# EAGLE design ToolTron_ToolBoxv2.0 (EAGLE 6.2)
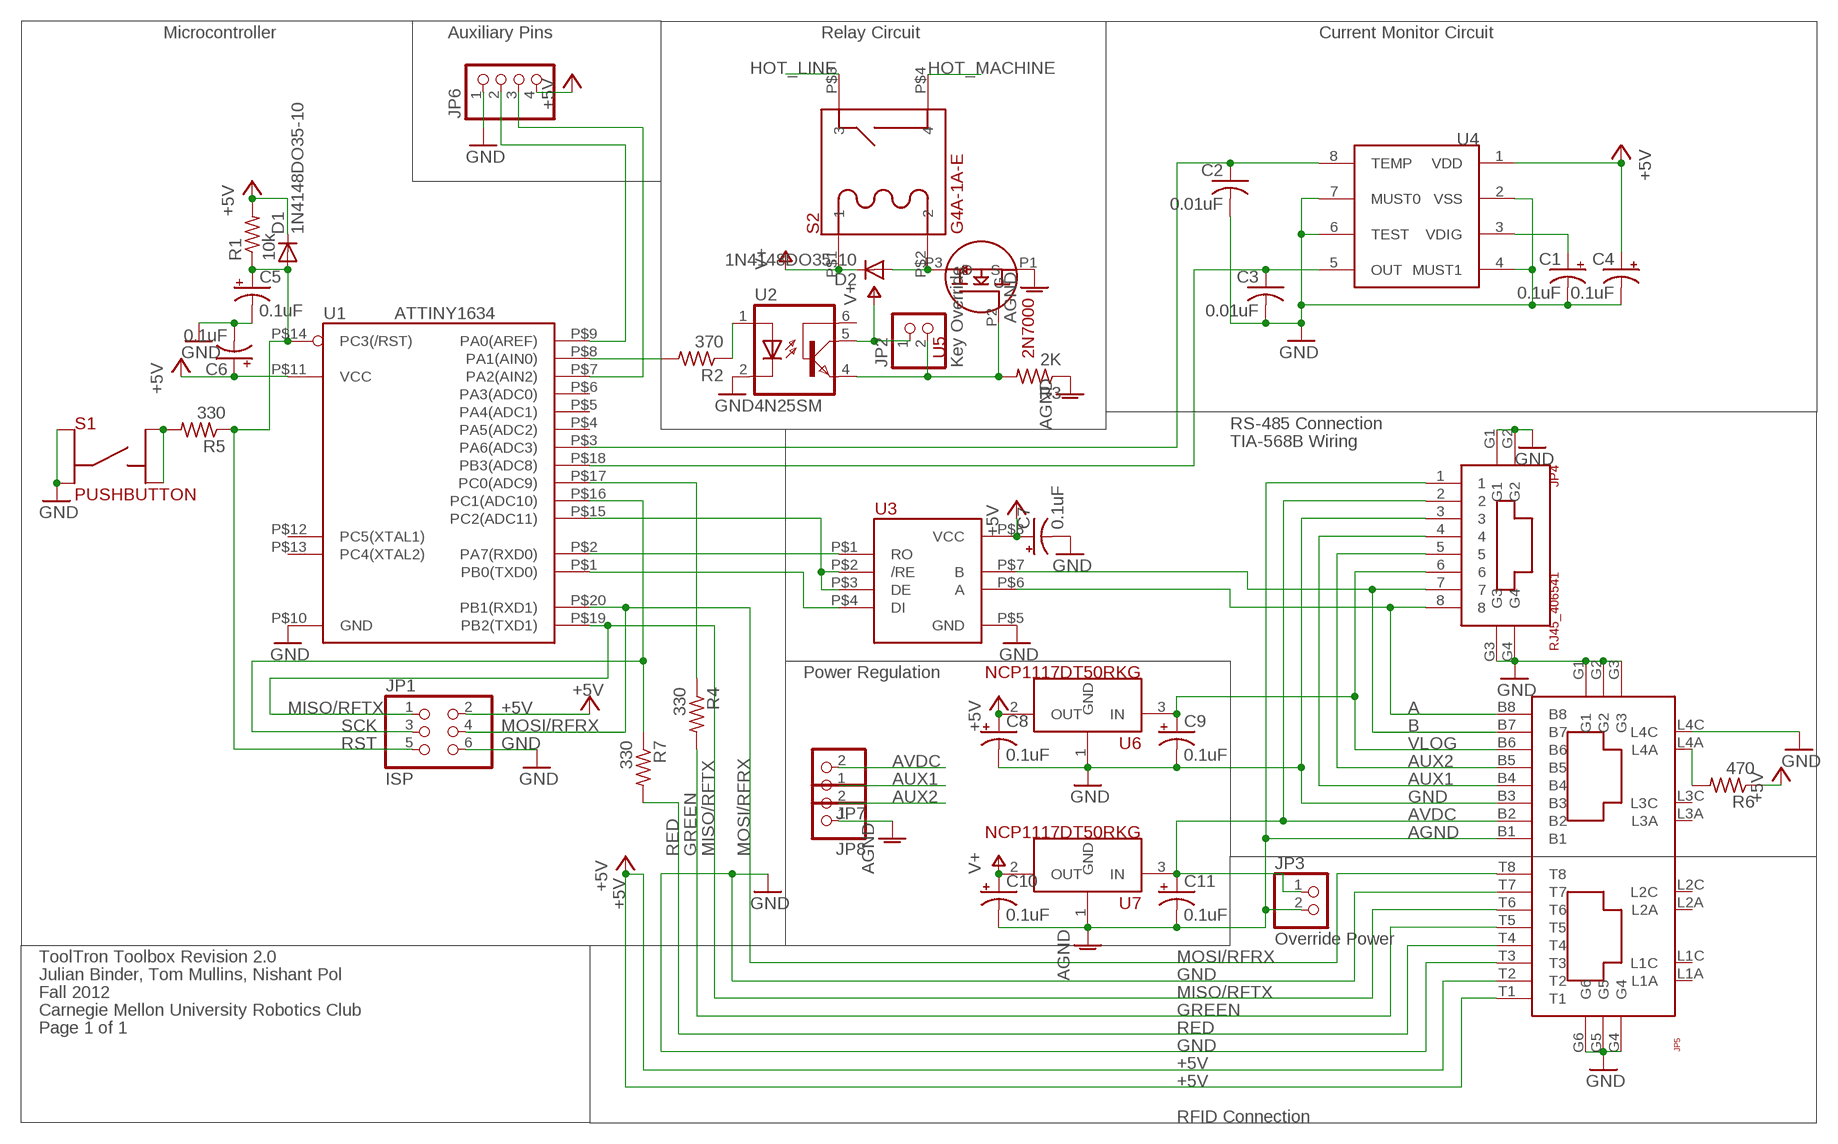
[diagram p0: schematic, sheet 1]

## Parts
C1  0.1uF  CPOL-USUD-4X5,8  [UD-4X5,8_NICHICON]
C2  0.01uF  C-USC0805  [C0805]
C3  0.01uF  C-USC0805  [C0805]
C4  0.1uF  CPOL-USUD-4X5,8  [UD-4X5,8_NICHICON]
C5  0.1uF  CPOL-USE2-5  [E2-5]
C6  0.1uF  CPOL-USE2-5  [E2-5]
C7  0.1uF  CPOL-USE2-5  [E2-5]
C8  0.1uF  CPOL-USE2-5  [E2-5]
C9  0.1uF  CPOL-USE2-5  [E2-5]
C10  0.1uF  CPOL-USUD-4X5,8  [UD-4X5,8_NICHICON]
C11  0.1uF  CPOL-USUD-4X5,8  [UD-4X5,8_NICHICON]
D1  1N4148DO35-10  [DO35-10]
D2  1N4148DO35-10  [DO35-10]
JP1  ISP  PINHD-2X3  [2X03]
JP2  Key Override  HEADER-1X2  [1X02_OVAL]
JP3  Override Power  HEADER-1X2  [1X02_OVAL]
JP4  RJ45_406541  [1-406541-1]
JP5  2XRJ45_RJSAE538X02X  [RJSAE538X02X]
JP6  HEADER-1X4ROUND  [1X04_ROUND]
JP7  HEADER-1X2ROUND  [1X02_ROUND]
JP8  HEADER-1X2ROUND  [1X02_ROUND]
R1  10k  R-US_0207/10  [0207/10]
R2  370  R-US_0207/10  [0207/10]
R3  2K  R-US_0207/10  [0207/10]
R4  330  R-US_0207/10  [0207/10]
R5  330  R-US_0207/10  [0207/10]
R6  470  R-US_0207/10  [0207/10]
R7  330  R-US_0207/10  [0207/10]
S1  PUSHBUTTON  [FSM4JH]
S2  G4A-1A-E  [G4A-1A-E]
U1  ATTINY1634  [SOIC-20]
U2  4N25SM  [DIL6-SMD]
U3  MAX13082E  [SOIC-8]
U4  MLX91206  [SOIC-8]
U5  2N7000  [TO-92]
U6  NCP1117DT50RKG  [DPAK]
U7  NCP1117DT50RKG  [DPAK]

## Nets
+5V: C4.+ C6.+ C7.+ C8.+ D1.C JP1.2 JP5.T1 JP5.T2 JP6.4 R1.2 R6.1 U1.P$11(VCC) U3.P$8(VCC) U4.1(VDD) U6.2(OUT)
A: JP4.8 JP5.B8 U3.P$6(A)
AGND: C10.- C11.- JP3.2 JP4.1 JP5.B1 JP8.1 R3.1 U5.P1(S) U7.1(GND)
AUX1: JP4.4 JP5.B4 JP7.1
AUX2: JP4.5 JP5.B5 JP8.2
AVDC: C11.+ JP3.1 JP4.2 JP5.B2 JP7.2 U7.3(IN)
B: JP4.7 JP5.B7 U3.P$7(B)
DI: U1.P$1(PB0(TXD0)) U3.P$4(DI)
EN: U1.P$15(PC2(ADC11)) U3.P$2(/RE) U3.P$3(DE)
GND: C1.- C2.2 C3.2 C4.- C5.- C6.- C7.- C8.- C9.- JP1.6 JP4.3 JP4.G1 JP4.G2 JP4.G3 JP4.G4 JP5.B3 JP5.G1 JP5.G2 JP5.G3 JP5.G4 JP5.G5 JP5.G6 JP5.L4C JP5.T3 JP5.T7 JP6.1 S1.1 S1.2 U1.P$10(GND) U2.2(C) U3.P$5(GND) U4.2(VSS) U4.4(MUST1) U4.6(TEST) U4.7(MUST0) U6.1(GND)
GREEN: JP5.T5 R4.2
HOT_LINE: S2.P$3
HOT_MACHINE: S2.P$4
MISO/RFTX: JP1.1 JP5.T6 U1.P$19(PB2(TXD1))
MOSI/RFRX: JP1.4 JP5.T8 U1.P$20(PB1(RXD1))
N$1: D2.A S2.P$2 U5.P3(D)
N$2: R5.2 S1.3 S1.4
N$3: C3.1 U1.P$18(PB3(ADC8)) U4.5(OUT)
N$4: C1.+ U4.3(VDIG)
N$5: C2.1 U1.P$3(PA6(ADC3)) U4.8(TEMP)
N$8: R2.2 U1.P$8(PA1(AIN0))
N$10: R2.1 U2.1(A)
N$11: JP2.2 R3.2 U2.4(EMI) U5.P2(G)
N$16: JP5.L4A R6.2
N$18: JP5.L1C
N$19: R4.1 U1.P$17(PC0(ADC9))
PA0: JP6.2 U1.P$9(PA0(AREF))
PA2: JP6.3 U1.P$7(PA2(AIN2))
RED: JP5.T4 R7.2
RO: U1.P$2(PA7(RXD0)) U3.P$1(RO)
RST: C5.+ D1.A JP1.5 R1.1 R5.1 U1.P$14(PC3(/RST))
SCK: JP1.3 R7.1 U1.P$16(PC1(ADC10))
V+: C10.+ D2.C JP2.1 S2.P$1 U2.5(COL) U7.2(OUT)
VLOG: C9.+ JP4.6 JP5.B6 U6.3(IN)
Unconnected: JP5.L1A JP5.L2A JP5.L2C JP5.L3A JP5.L3C U1.P$4(PA5(ADC2)) U1.P$5(PA4(ADC1)) U1.P$6(PA3(ADC0)) U1.P$12(PC5(XTAL1)) U1.P$13(PC4(XTAL2)) U2.6(BAS)

## Notes on the sheet
- Microcontroller | Auxiliary Pins | Relay Circuit | Current Monitor Circuit
- RS-485 Connection
- TIA-568B Wiring
- Power Regulation
- ToolTron Toolbox Revision 2.0
- Julian Binder, Tom Mullins, Nishant Pol
- Fall 2012
- Carnegie Mellon University Robotics Club
- Page 1 of 1
- RFID Connection

## Library data of the parts
C1 C4-C11 = rcl:CPOL-US: POLARIZED CAPACITOR, American symbol
C2 C3 = rcl:C-US: CAPACITOR, American symbol
D1 D2 = diode:1N4148: DIODE high speed (Philips)
JP1 = pinhead:PINHD-2X3: PIN HEADER
JP2 JP3 JP7 JP8 = microbuilder:HEADER-1X2: PIN HEADER
JP4 = npol_custom:RJ45_406541: RJ45 Jack TE Connectivity 1-406541-1 Digikey A97716-ND
JP5 = npol_custom:2XRJ45_RJSAE538X02X: Double RJ45 Jack Amphenol RJSAE538002 Digikey RJSAE538002-ND
JP6 = microbuilder:HEADER-1X4: PIN HEADER
R1-R7 = rcl:R-US_: RESISTOR, American symbol
S1 = npol_custom:PUSHBUTTON
S2 = power_custom:G4A-1A-E
U1 = npol_custom:ATTINY1634
U2 = optocoupler:4N*?M: General Purpose 6-Pin Phototransistor Optocouplers Source: http://www.fairchildsemi.com/ds/4N/4N35-M.pdf; MF: FAIRCHILD SEMICONDUCTOR; MPN: 4N25SM; OC_FARNELL: 1021152; OC_NEWARK: 34C2020
U3 = IC_custom:MAX13082E
U4 = melexis_2:MLX91206
U5 = IC_custom:2N7000: N-Channel MOSFET 400mA 60V
U6 U7 = npol_custom:NCP1117DT50RKG

## Board
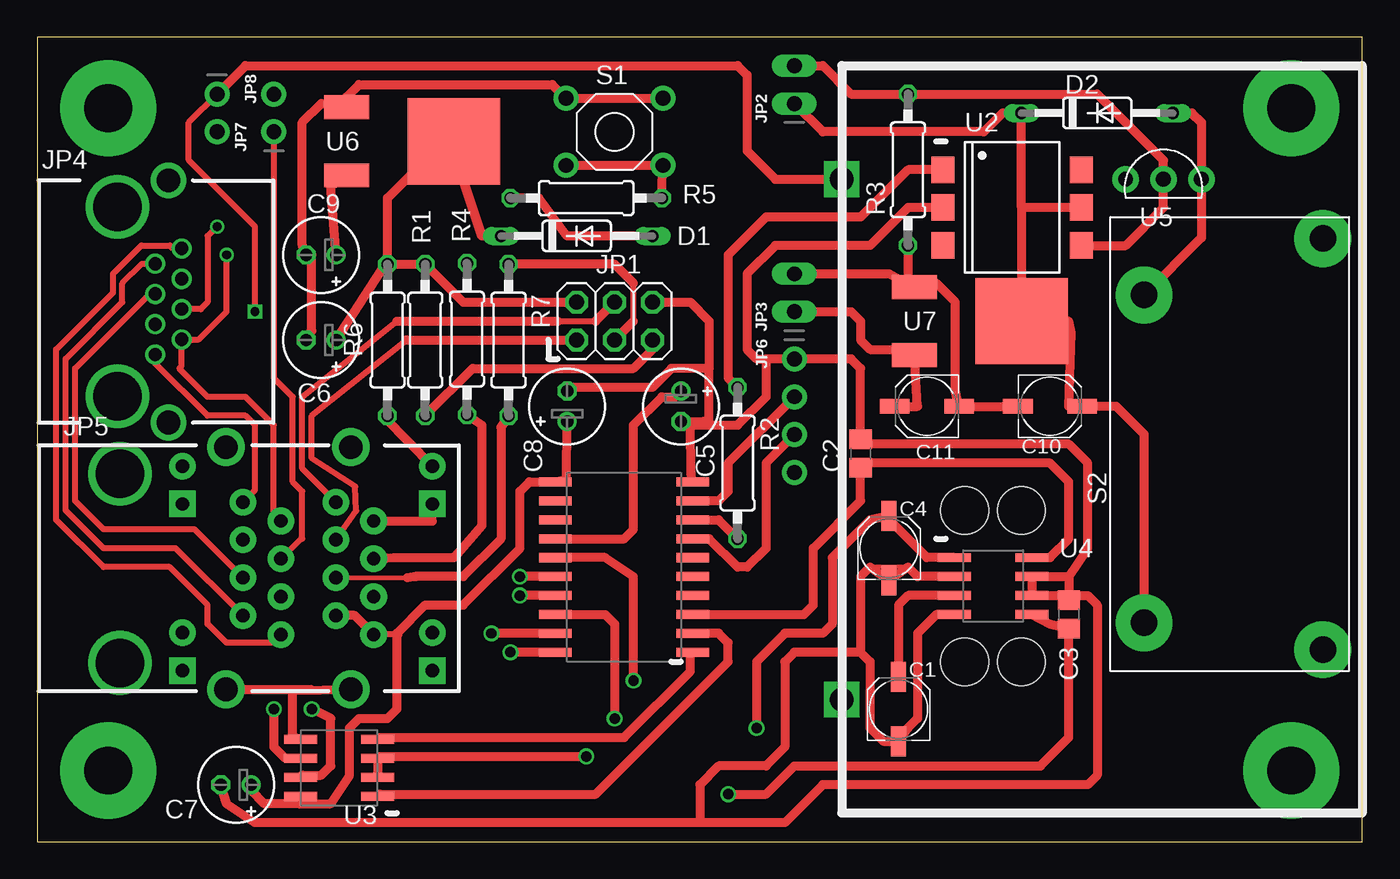
[diagram p1: board, top side]
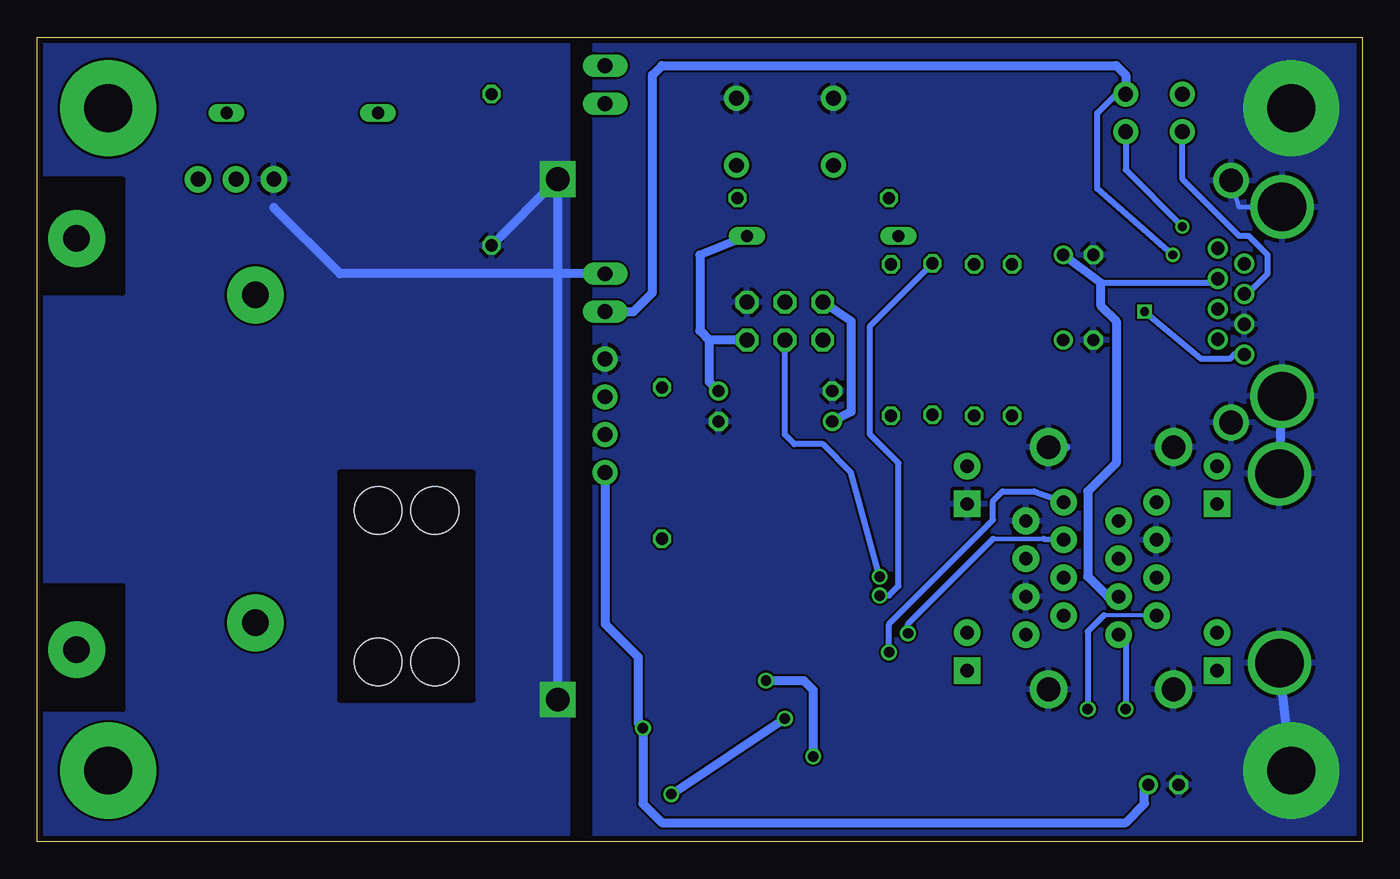
[diagram p2: board, bottom side, seen from below]

Size 88.9 x 53.98 mm. Coordinates in mm from the lower left corner, seen from the top.
Outline: 0,0 88.9,0 88.9,53.98 0,53.98 0,0
Copper layers (1*16): Top 0.0356mm / dielectric 1.5011mm / Bottom 0.0356mm
Design rules: minimum track width 6mil, minimum drill 13mil, track to track 6mil, track to pad 6mil, pad to pad 6mil, via to via 6mil, smd to smd 6mil, copper to edge 15mil, drill to drill 6mil, minimum pad ring 7mil, minimum via ring 7mil, stop-mask expansion 4mil, vias tented up to drill 0mil, thermal gap 10mil
Holes 3.2 mm at 66.04,12.06 62.23,12.06 66.04,22.23 62.23,22.23

### Footprints (pad centres in the part's own frame; a part is rotated, then mirrored left to right if it is on the bottom)
UD-4X5,8_NICHICON = smd 2 x 1: + 2.159,0; - -2.159,0
C0805 = smd 1.3 x 1.5: 1 -0.95,0; 2 0.95,0
E2-5 = drill 0.813 pad 1.27: + -1.016,0 | drill 0.813 pad 1.27 octagon: - 1.016,0
DO35-10 = drill 0.813 long: A 5.08,0; C -5.08,0
2X03 = drill 1.016 octagon: 1 -2.54,-1.27; 2 -2.54,1.27; 3 0,-1.27; 4 0,1.27; 5 2.54,-1.27; 6 2.54,1.27
1X02_OVAL = drill 1 long: 1 -1.27,0; 2 1.27,0
1-406541-1 = drill 0.9: 1 3.556,2.54; 2 2.54,4.318; 3 1.524,2.54; 4 0.508,4.318; 5 -0.508,2.54; 6 -1.524,4.318; 7 -2.54,2.54; 8 -3.556,4.318 | drill 3.251: G1 6.35,0; G2 -6.35,0 | drill 1.6: G3 8.128,3.429; G4 -8.128,3.429
RJSAE538X02X = drill 0.9 pad 1.778: B1 -4.445,8.255; B2 -3.175,10.795; B3 -1.905,8.255; B4 -0.635,10.795; B5 0.635,8.255; B6 1.905,10.795; B7 3.175,8.255; B8 4.445,10.795; L1A 4.318,4.191; L2A -6.858,4.191; L3A 4.318,20.955; L4A -6.858,20.955; T1 4.445,17.018; T2 3.175,14.478; T3 1.905,17.018; T4 0.635,14.478; T5 -0.635,17.018; T6 -1.905,14.478; T7 -3.175,17.018; T8 -4.445,14.478 | drill 1.587 pad 2.54: G1 8.128,7.112; G2 8.128,15.494; G3 -8.128,7.112; G4 -8.128,15.494 | drill 3.251 pad 3.81: G5 -6.35,0; G6 6.35,0 | drill 0.9 pad 1.778 square: L1C 6.858,4.191; L2C -4.318,4.191; L3C 6.858,20.955; L4C -4.318,20.955
1X04_ROUND = drill 1 pad 1.676: 1 -3.81,0; 2 -1.27,0; 3 1.27,0; 4 3.81,0
1X02_ROUND = drill 1 pad 1.676: 1 -1.27,0; 2 1.27,0
0207/10 = drill 0.813 octagon: 1 -5.08,0; 2 5.08,0
FSM4JH = drill 1 pad 1.676: 1 -3.251,2.248; 2 3.251,2.248; 3 -3.251,-2.248; 4 3.251,-2.248
G4A-1A-E = drill 1.778 pad 3.81: P$1 11.989,-5.74; P$2 -10.008,-5.74; P$3 -13.792,6.248; P$4 13.792,6.248
SOIC-20 = smd 2.184 x 0.61: P$1 -4.597,5.715; P$2 -4.597,4.445; P$3 -4.597,3.175; P$4 -4.597,1.905; P$5 -4.597,0.635; P$6 -4.597,-0.635; P$7 -4.597,-1.905; P$8 -4.597,-3.175; P$9 -4.597,-4.445; P$10 -4.597,-5.715; P$11 4.597,-5.715; P$12 4.597,-4.445; P$13 4.597,-3.175; P$14 4.597,-1.905; P$15 4.597,-0.635; P$16 4.597,0.635; P$17 4.597,1.905; P$18 4.597,3.175; P$19 4.597,4.445; P$20 4.597,5.715
DIL6-SMD = smd 1.78 x 1.52: 1 -2.54,-4.645; 2 0,-4.645; 3 2.54,-4.645; 4 2.54,4.645; 5 0,4.645; 6 -2.54,4.645
SOIC-8 = smd 2.21 x 0.61: P$1 -2.591,1.905; P$2 -2.591,0.635; P$3 -2.591,-0.635; P$4 -2.591,-1.905; P$5 2.591,-1.905; P$6 2.591,-0.635; P$7 2.591,0.635; P$8 2.591,1.905
SOIC-8' = smd 2.2 x 0.6: 1 -2.6,1.905; 2 -2.6,0.635; 3 -2.6,-0.635; 4 -2.6,-1.905; 5 2.6,-1.905; 6 2.6,-0.635; 7 2.6,0.635; 8 2.6,1.905
TO-92 = drill 1 pad 1.778: P1 2.54,0; P2 0,0; P3 -2.54,0
DPAK = smd 2.997 x 1.6: 1 7.188,-2.286; 3 7.188,2.286 | smd 6.198 x 5.791: 2 0,0

### Placement (x,y rotation side)
C1  57.78,8.89 90 top
C2  55.24,26.04 90 top
C3  69.22,15.24 90 top
C4  57.15,19.68 90 top
C5  43.18,29.21 270 top
C6  19.05,33.66 180 top
C7  13.34,3.81 180 top
C8  35.56,29.21 90 top
C9  19.05,39.37 180 top
C10  67.94,29.21 0 top
C11  59.69,29.21 180 top
D1  36.2,40.64 0 top
D2  71.12,48.9 0 top
JP1  38.73,34.92 0 top
JP2  50.8,50.8 90 top
JP3  50.8,36.83 90 top
JP4  5.37,36.24 270 top
JP5  5.55,18.34 270 top
JP6  50.8,28.57 270 top
JP7  15.88,48.9 90 top
JP8  12.06,48.9 270 top
R1  26.04,33.66 90 top
R2  46.99,25.4 270 top
R3  58.42,45.09 90 top
R4  28.83,33.72 270 top
R5  36.83,43.18 0 top
R6  23.5,33.66 270 top
R7  31.62,33.66 270 top
S1  38.73,47.62 0 top
S2  80.01,26.67 270 top
U1  39.37,18.41 180 top
U2  65.41,42.55 270 top
U3  20.26,4.95 180 top
U4  MLX91206  [SOIC-8']  64.14,17.14 0 top
U5  75.56,44.45 180 top
U6  27.94,46.99 180 top
U7  66.04,34.92 180 top

### Tracks (layer width: path | path; a pad name or v marks a point on that pad's centre or on a via)
+5V  (via drill 0.7)
  Top 0.406: U3.P$8 17.54,2.54 | 24.21,13.89 JP5.T1
  Top 0.61: U4.1 59.69,19.05 57.4,21.34 C4.+ 55.88,21.59 53.34,19.05 53.34,14.61 52.7,13.97 50.16,13.97 48.26,12.06 v48.26,7.62 | C6.+ 23.5,38.99 | 23.5,38.99 R6.1 R1.2 28.57,36.2 JP1.2 | 23.5,38.99 23.5,43.18 27.3,46.99 U6.2 28.57,46.35 28.57,44.45 29.84,40.64 D1.C | C7.+ 14.35,3.43 15.24,2.54 17.54,2.54 19.68,2.54 20.95,4.45 20.95,7.62 21.59,8.26 23.5,8.26 24.13,8.89 24.13,13.97 | 24.13,13.97 24.21,13.89 | JP5.T1 21.3,15.16 JP5.T2 | 24.13,13.97 26.04,15.88 28.57,15.88 32.38,19.68 32.38,23.5 33.02,24.13 U1.P$11 35.51,24.33 C8.+
  Bottom 0.61: JP1.2 34.29,34.92 34.29,28.83 C8.+ | C7.+ 14.61,3.56 14.61,2.54 15.88,1.27 46.99,1.27 48.26,2.54 v48.26,7.62 48.58,7.94 48.58,12.38 50.8,14.61 JP6.4
A  (via drill 0.7)
  Top 0.406: 16.64,5.59 U3.P$6 | JP5.B8 15.79,13.34 12.7,13.34 11.43,14.61 11.43,15.88 8.89,18.41 4.45,18.41 1.27,21.59 1.27,33.02 5.08,36.83 5.08,38.1 6.99,40.01 8.89,40.01 9.1,39.8 JP4.8
  Top 0.61: v15.88,8.89 15.88,6.35 16.64,5.59
  Bottom 0.305: JP5.B8 16.42,13.97
  Bottom 0.406: JP5.B8 16.51,13.73 16.9,13.73 15.88,13.34 v15.88,8.89
AGND  (via drill 0.6, 1.6)
  Top 0.406: JP5.B1 14.61,23.58 14.61,27.94 13.97,28.57 11.43,28.57 7.91,32.09 JP4.1 | v14.61,35.56 14.61,41.27 10.16,45.72 10.16,48.26 JP8.1
  Top 0.61: C10.- C11.- 61.59,30.23 61.59,36.2 60.33,37.47 60.07,37.21 U7.1 | JP3.2 57.15,38.1 U7.1 | R3.1 58.42,37.64 U7.1 | v53.98,44.45 49.53,44.45 47.62,46.35 47.62,51.44 46.99,52.07 13.97,52.07 JP8.1
  Bottom 0.406: JP4.1 8.59,32.68 8.89,32.38 10.79,32.38 v14.61,35.56
  Bottom 0.61: v53.98,9.53 v53.98,44.45 R3.1 | JP3.2 68.58,38.1 73.03,42.55
  pour Bottom: 88.9,0 88.9,53.98 53.34,53.98 53.34,0
AUX1  (via drill 0.6)
  Top 0.406: JP5.B4 17.69,20.32 17.78,20.32 17.78,23.5 17.14,24.13 17.14,29.84 15.88,31.11 JP7.1 | v12.06,41.27 11.43,40.64 11.43,36.2 10.97,35.73 JP4.4
  Bottom 0.406: JP7.1 15.88,45.09 v12.06,41.27
AUX2
  Top 0.406: JP5.B5 10.55,20.95 4.45,20.95 2.54,22.86 2.54,31.75 7.54,36.75 JP4.5
  Bottom 0.406: JP4.5 7.7,36.75 6.35,38.1 6.35,39.37 7.62,40.64 8.26,40.64 12.06,44.45 JP8.2
AVDC  (via drill 0.6)
  Top 0.406: JP5.B2 15.88,21.98 15.88,27.94 13.97,29.84 11.43,29.84 9.53,31.75 9.69,31.91 JP4.2 10.84,33.7 12.7,35.56 v12.7,39.37
  Top 0.61: C11.+ 59.05,29.21 U7.3 58.42,33.02 55.88,33.02 55.24,33.66 55.24,34.92 54.61,35.56 JP3.1
  Bottom 0.406: v12.7,39.37 17.78,43.81 17.78,48.9 16.51,50.16 JP7.2
  Bottom 0.61: JP3.1 48.9,35.56 47.62,36.83 47.62,51.44 46.99,52.07 16.51,52.07 15.88,51.44 JP7.2
B  (via drill 0.7)
  Top 0.406: JP5.B7 9.28,19.68 4.45,19.68 1.91,22.23 1.91,32.38 5.71,36.2 5.71,37.47 7.03,38.78 JP4.7
  Top 0.61: v18.41,8.89 19.68,8.26 19.68,5.08 19.05,4.45 17.78,4.45 17.78,4.32 U3.P$7
  Bottom 0.254: JP5.B7 15.09,15.18 17.34,15.18
  Bottom 0.406: 17.34,15.18 18.41,14.1 v18.41,8.89
DI
  Top 0.406: U3.P$4 22.97,6.99
  Top 0.61: 22.97,6.99 39.37,6.99 43.81,11.43 43.81,12.7 U1.P$1
EN  (via drill 0.7)
  Top 0.406: U3.P$3 22.97,5.71
  Top 0.61: U3.P$3 U3.P$2 | 22.97,5.71 v36.83,5.71 | v40.01,10.79 40.01,17.78 38.1,19.05 U1.P$15
  Bottom 0.61: v36.83,5.71 36.83,10.16 37.47,10.79 v40.01,10.79
GND  (via drill 3.2 pad 6.45)
  Top 0.254: 58.42,18.41 55.88,18.41
  Top 0.61: U1.P$10 43.87,24.71 43.81,27.94 | 43.18,27.94 43.43,27.94 | 43.56,27.94 C5.- | U3.P$5 17.14,6.99 17.14,10.16 | 17.14,10.16 JP5.G2 | 69.22,17.78 70.48,19.68 70.48,25.4 69.22,26.67 55.88,26.67 C2.2 55.56,27.3 55.24,27.3 55.24,31.75 54.61,32.38 JP6.1 48.9,32.38 | U4.4 60.33,15.24 59.05,13.97 59.05,8.26 58.42,7.62 C1.- 56.77,6.73 55.88,7.62 55.88,12.06 55.24,12.7 | 55.24,12.7 55.24,17.78 55.88,18.41 C4.- 58.42,18.41 59.05,17.78 U4.2 | 69.22,16.51 U4.6 U4.7 69.22,17.78 | 69.22,16.51 69.85,16.51 | 69.85,16.51 C3.2 | 69.22,17.78 69.22,16.51 | 69.85,16.51 70.48,16.51 71.12,15.88 71.12,4.45 70.48,3.81 52.7,3.81 50.16,1.27 44.45,1.27 | 44.45,1.27 14.61,1.27 12.7,2.54 C7.- | C6.- 18.41,34.29 18.41,39.37 C9.- 17.78,40.01 17.78,48.26 19.05,49.53 U6.1 20.75,49.96 21.59,50.8 34.56,50.8 S1.1 S1.2 | JP5.G1 18.36,10.21 17.14,10.16 | 43.43,27.94 43.56,27.94 | 43.56,27.94 43.81,27.94 | 43.81,27.94 45.09,27.94 | 45.09,27.94 46.99,27.94 48.9,29.84 48.9,32.38 | 43.43,27.94 C5.- | C5.- 44.7,28.19 45.09,27.94 | 45.09,27.94 45.09,31.75 | 45.09,31.75 42.55,31.75 41.27,30.48 35.81,30.48 C8.- | JP1.6 43.81,36.2 45.09,34.92 45.09,31.75 | U2.2 58.42,42.55 55.88,40.01 49.53,40.01 47.62,38.1 47.62,33.02 48.26,32.38 48.9,32.38 | 55.24,12.7 50.8,12.7 50.16,12.06 50.16,6.35 48.9,5.08 45.72,5.08 44.45,3.81 44.45,1.27 | JP5.T7 26.5,21.51 JP5.L4C
  Bottom 0.305: JP4.G2 8.29,42.59 JP4.G4
  Bottom 0.61: JP5.G5 JP4.G1 | v4.76,4.76 JP5.G6 | C9.- 17.78,39.37 | JP5.G4 19.89,26.47
  other vias: 4.76,49.21 84.14,4.76 84.14,49.21
  pour Bottom: 0,53.98 0,0 50.8,0 51.44,0 51.44,53.98
GREEN
  Top 0.61: JP5.T5 23.91,19.05 27.94,19.05 28.19,19.3 29.84,21.21 29.84,27.94 R4.2
MISO/RFTX  (via drill 0.7)
  Top 0.406: JP5.T6 21.4,22.19 21.34,23.81 18.41,25.72 18.41,28.57 24.77,33.66
  Top 0.61: 24.77,33.66 JP1.1 | U1.P$19 v30.48,13.97
  Bottom 0.305: 24.77,20.32 21.37,20.32
  Bottom 0.406: v30.48,13.97 30.48,14.61 24.77,20.32 | 21.37,20.32 JP5.T6
MOSI/RFRX  (via drill 0.7)
  Top 0.406: JP5.T8 17.78,25.03 17.78,29.84 24.13,34.92 | 34.92,34.92 37.47,34.92
  Top 0.61: 24.13,34.92 34.92,34.92 | 37.47,34.92 JP1.4 | U1.P$20 v31.75,12.7
  Bottom 0.406: v31.75,12.7 31.75,14.61 24.77,21.59 24.77,22.86 24.13,23.5 22.01,23.5 JP5.T8
N$1
  Top 0.61: D2.A 77.47,48.9 78.11,48.26 U5.P3 78.11,40.51 S2.P$2
N$2
  Top 0.61: R5.2 41.91,44.18 S1.4 S1.3
N$3  (via drill 0.7)
  Top 0.61: U1.P$18 38.1,15.24 38.73,14.61 v38.73,8.26 | v46.35,3.17 48.9,3.17 50.8,5.08 67.31,5.08 69.22,6.99 C3.1 67.94,14.61 U4.5
  Bottom 0.61: v38.73,8.26 v46.35,3.17
N$4
  Top 0.61: U4.3 58.42,16.51 57.78,15.88 C1.+
N$5
  Top 0.61: U4.8 67.94,19.05 69.22,20.32 69.22,24.13 67.94,25.4 55.88,25.4 C2.1 55.24,22.86 52.07,19.68 52.07,15.88 51.44,15.24 U1.P$3
N$6
  cutout Bottom: 59.69,24.77 67.94,24.77 68.58,24.77 68.58,9.53 59.69,9.53
N$7
  cutout Bottom: 88.9,17.14 83.19,17.14 83.19,8.89 88.9,8.89
N$8
  Top 0.61: U1.P$8 45.72,21.59 R2.2
N$9
  cutout Bottom: 88.9,44.45 83.19,44.45 83.19,36.83 88.9,36.83
N$10
  Top 0.61: U2.1 58.42,45.09 55.24,41.91 48.9,41.91 46.35,39.37 46.35,31.11 R2.1
N$11
  Top 0.61: U2.4 73.03,40.01 75.56,42.55 U5.P2 75.56,45.72 71.12,50.16 R3.2 54.61,50.16 52.7,52.07 JP2.2
N$16
  Top 0.61: R6.2 23.33,28.41 JP5.L4A
N$19  (via drill 0.7)
  Top 0.61: U1.P$17 v32.38,16.51
  Bottom 0.406: v32.38,16.51 31.75,16.51 31.11,17.14 31.11,25.4 33.02,27.3 33.02,34.61 R4.1
PA0
  Top 0.61: JP6.2 46.35,25.4 46.35,23.5 45.72,22.86 U1.P$9
PA2
  Top 0.61: JP6.3 48.9,25.4 48.9,19.68 47.62,18.41 46.99,18.41 45.09,20.32 U1.P$7
RED
  Top 0.305: 24.84,17.7 JP5.T4
  Top 0.61: R7.2 31.11,27.81 31.11,20.32 28.57,17.78 25.4,17.78 24.84,17.7
RO
  Top 0.406: U3.P$1 22.97,3.17
  Top 0.61: 22.97,3.17 37.47,3.17 46.35,12.06 46.35,13.34 45.72,13.97 U1.P$2 43.81,13.97
RST
  Top 0.61: R1.1 29.21,31.75 40.01,31.75 41.27,33.02 JP1.5 | U1.P$14 39.37,20.32 40.01,20.95 40.01,27.94 41.91,29.84 42.8,29.84 C5.+ | D1.A 35.56,40.64 33.66,43.18 R5.1
  Bottom 0.61: D1.A 44.45,39.37 44.45,34.29 43.81,33.66 | JP1.5 43.81,33.66 | 43.81,33.66 43.81,30.86 C5.+
SCK  (via drill 0.7)
  Top 0.406: 40.01,34.92 40.01,37.47
  Top 0.61: JP1.3 40.01,34.92 | 40.01,37.47 38.73,38.73 R7.1 | 35.56,17.78 34.92,17.78 U1.P$16 v32.38,17.78
  Bottom 0.406: v32.38,17.78 34.29,24.77 36.2,26.67 38.1,26.67 38.73,27.3 JP1.3
V+
  Top 0.61: S2.P$1 74.27,27.33 72.39,29.21 C10.+ 69.22,29.21 69.37,34.13 69.22,34.92 U7.2 66.04,42.55 | U2.5 66.04,42.55 | 66.04,42.55 D2.C 64.77,48.9 63.5,47.62 52.7,47.62 JP2.1
VLOG
  Top 0.61: C9.+ 19.68,44.07 20.95,44.45 21.97,44.7 U6.3
  Bottom 0.406: JP4.6 9.99,37.47 17.53,37.47
  Bottom 0.61: C9.+ 17.53,37.47 17.53,35.94 16.51,34.92 16.51,25.4 18.41,23.5 18.41,17.78 17.07,16.43 JP5.B6